# Altium schematic sheet digidisk.SchDoc
size A4; SheetNumber: 1; SheetTotal: 1
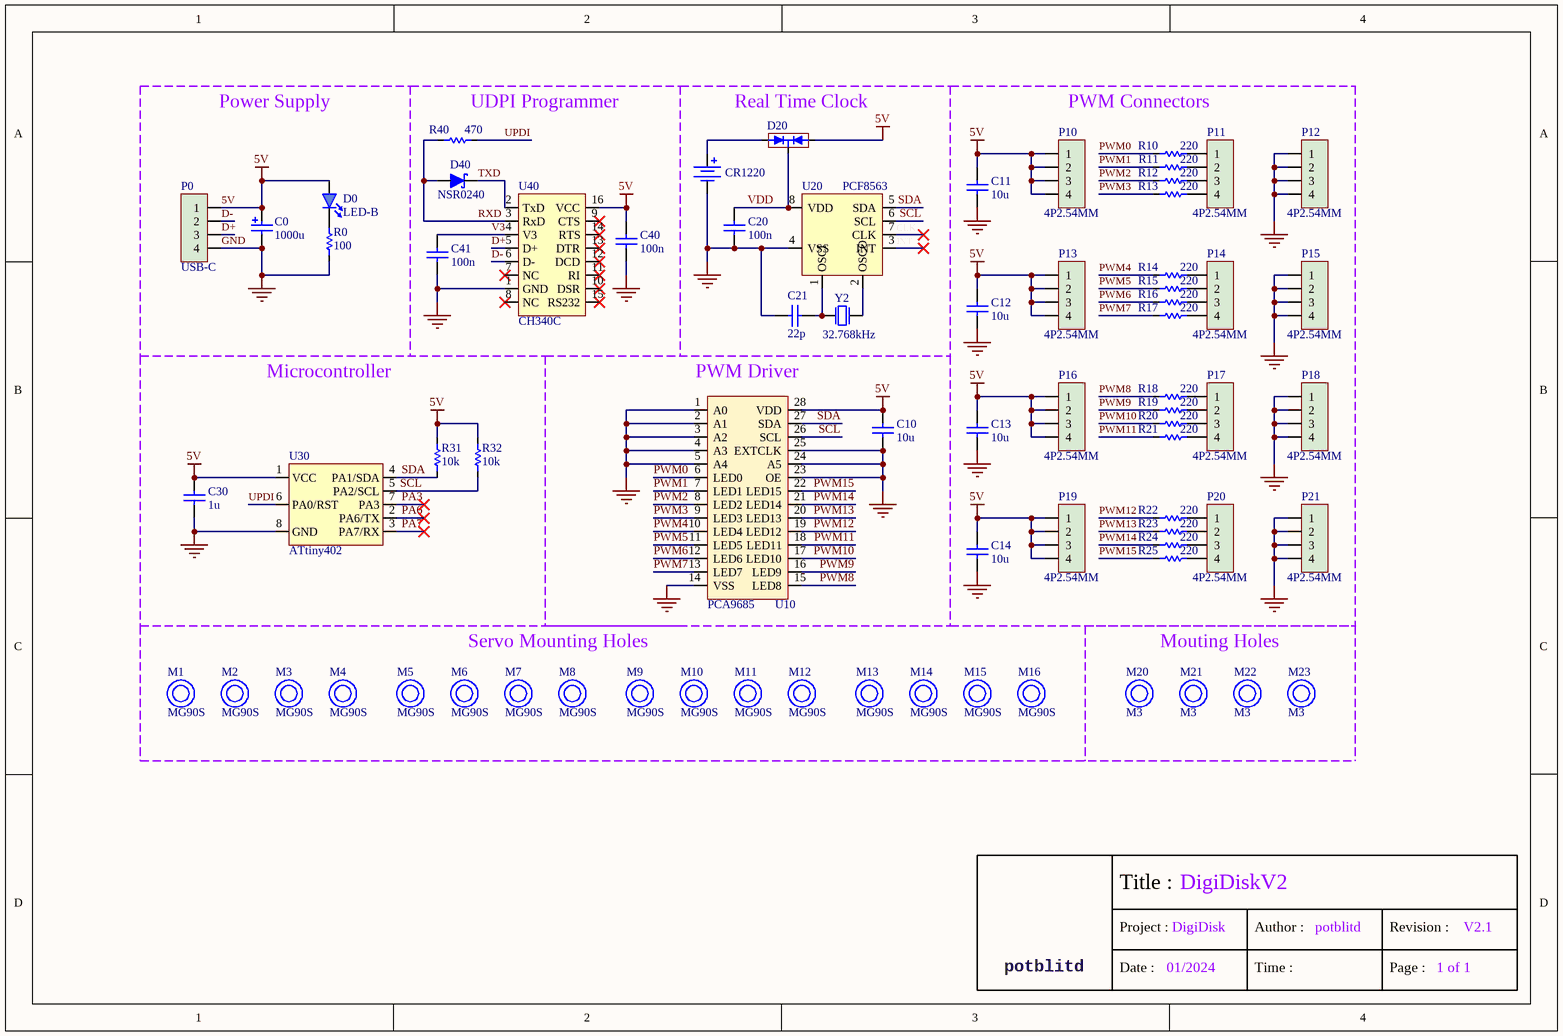
[diagram p0: digidisk.SchDoc]

## Parts
BT20  CR1220  [CR1220-H]
C0  1000u  [10X10.2]
C10  value 10u  [0603CM]  (hidden comment: Capacitor)
C11  value 10u  [0603CM]  (hidden comment: Capacitor)
C12  value 10u  [0603CM]  (hidden comment: Capacitor)
C13  value 10u  [0603CM]  (hidden comment: Capacitor)
C14  value 10u  [0603CM]  (hidden comment: Capacitor)
C20  value 100n  [0603CM]  (hidden comment: Capacitor)
C21  value 22p  [0603CM]  (hidden comment: Capacitor)
C30  value 1u  [0603CM]  (hidden comment: Capacitor)
C40  value 100n  [0603CM]  (hidden comment: Capacitor)
C41  value 100n  [0603CM]  (hidden comment: Capacitor)
D0  LED-B  [0603DM]
D20  BAS40-05  [SOT23-3 M]  (value not drawn)
D40  NSR0240  [SOD-323 M]
M1  MG90S  [HOLE-SG90-2]
M2  MG90S  [HOLE-SG90-2]
M3  MG90S  [HOLE-SG90-2]
M4  MG90S  [HOLE-SG90-2]
M5  MG90S  [HOLE-SG90-2]
M6  MG90S  [HOLE-SG90-2]
M7  MG90S  [HOLE-SG90-2]
M8  MG90S  [HOLE-SG90-2]
M9  MG90S  [HOLE-SG90-2]
M10  MG90S  [HOLE-SG90-2]
M11  MG90S  [HOLE-SG90-2]
M12  MG90S  [HOLE-SG90-2]
M13  MG90S  [HOLE-SG90-2]
M14  MG90S  [HOLE-SG90-2]
M15  MG90S  [HOLE-SG90-2]
M16  MG90S  [HOLE-SG90-2]
M20  M3  [HOLE-M3-simple]
M21  M3  [HOLE-M3-simple]
M22  M3  [HOLE-M3-simple]
M23  M3  [HOLE-M3-simple]
P0  USB-C  [USB-C module 2.8mm]
P10  4P2.54MM  [4P-2.54mm]
P11  4P2.54MM  [4P-2.54mm]
P12  4P2.54MM  [4P-2.54mm]
P13  4P2.54MM  [4P-2.54mm]
P14  4P2.54MM  [4P-2.54mm]
P15  4P2.54MM  [4P-2.54mm]
P16  4P2.54MM  [4P-2.54mm]
P17  4P2.54MM  [4P-2.54mm]
P18  4P2.54MM  [4P-2.54mm]
P19  4P2.54MM  [4P-2.54mm]
P20  4P2.54MM  [4P-2.54mm]
P21  4P2.54MM  [4P-2.54mm]
R0  value 100  [0603RM]  (hidden comment: Resistor)
R10  value 220  [0603RM]  (hidden comment: Resistor)
R11  value 220  [0603RM]  (hidden comment: Resistor)
R12  value 220  [0603RM]  (hidden comment: Resistor)
R13  value 220  [0603RM]  (hidden comment: Resistor)
R14  value 220  [0603RM]  (hidden comment: Resistor)
R15  value 220  [0603RM]  (hidden comment: Resistor)
R16  value 220  [0603RM]  (hidden comment: Resistor)
R17  value 220  [0603RM]  (hidden comment: Resistor)
R18  value 220  [0603RM]  (hidden comment: Resistor)
R19  value 220  [0603RM]  (hidden comment: Resistor)
R20  value 220  [0603RM]  (hidden comment: Resistor)
R21  value 220  [0603RM]  (hidden comment: Resistor)
R22  value 220  [0603RM]  (hidden comment: Resistor)
R23  value 220  [0603RM]  (hidden comment: Resistor)
R24  value 220  [0603RM]  (hidden comment: Resistor)
R25  value 220  [0603RM]  (hidden comment: Resistor)
R31  value 10k  [0603RM]  (hidden comment: Resistor)
R32  value 10k  [0603RM]  (hidden comment: Resistor)
R40  value 470  [0603RM]  (hidden comment: Resistor)
U10  PCA9685  [TSSOP-28 M]
U20  PCF8563  [SOP-8 M]
U30  ATtiny402  [SOP-8 M]
U40  CH340C  [SOP-16 M]
Y2  value 32.768kHz  [FC135 M]  (hidden comment: Oscillator)

## Nets
5V: C0.1(+) C10.1 C11.1 C12.1 C13.1 C14.1 C30.2 C40.1 D0.1 D20.1 P0.1 P10.1 P10.2 P10.3 P10.4 P13.1 P13.2 P13.3 P13.4 P16.1 P16.2 P16.3 P16.4 P19.1 P19.2 P19.3 P19.4 R31.2 R32.2 U10.28(VDD) U30.1(VCC) U40.16(VCC)
GND: BT20.2(-) C0.2(-) C10.2 C11.2 C12.2 C13.2 C14.2 C20.2 C21.2 C30.1 C40.2 C41.2 P0.4 P12.1 P12.2 P12.3 P12.4 P15.1 P15.2 P15.3 P15.4 P18.1 P18.2 P18.3 P18.4 P21.1 P21.2 P21.3 P21.4 R0.1 U10.1(A0) U10.2(A1) U10.3(A2) U10.4(A3) U10.5(A4) U10.14(VSS) U10.23(OE) U10.24(A5) U10.25(EXTCLK) U20.4(VSS) U30.8(GND) U40.1(GND)
CLK: U20.7(CLK)
D+: P0.3 U40.5(D+)
D-: P0.2 U40.6(D-)
INT: U20.3(INT)
PA3: U30.7(PA3)
PA6: U30.2(PA6/TX)
PA7: U30.3(PA7/RX)
PWM0: R10.2 U10.6(LED0)
PWM1: R11.2 U10.7(LED1)
PWM2: R12.2 U10.8(LED2)
PWM3: R13.2 U10.9(LED3)
PWM4: R14.2 U10.10(LED4)
PWM5: R15.2 U10.11(LED5)
PWM6: R16.2 U10.12(LED6)
PWM7: R17.2 U10.13(LED7)
PWM8: R18.2 U10.15(LED8)
PWM9: R19.2 U10.16(LED9)
PWM10: R20.2 U10.17(LED10)
PWM11: R21.2 U10.18(LED11)
PWM12: R22.2 U10.19(LED12)
PWM13: R23.2 U10.20(LED13)
PWM14: R24.2 U10.21(LED14)
PWM15: R25.2 U10.22(LED15)
RXD: D40.1(A) R40.2 U40.3(RxD)
SCL: R32.1 U10.26(SCL) U20.6(SCL) U30.5(PA2/SCL)
SDA: R31.1 U10.27(SDA) U20.5(SDA) U30.4(PA1/SDA)
TXD: D40.2(C) U40.2(TxD)
UPDI: R40.1 U30.6(PA0/RST)
V3: C41.1 U40.4(V3)
VDD: C20.1 D20.3 U20.8(VDD)
NetBT20_1: BT20.1(+) D20.2
NetC21_1: C21.1 U20.1(OSCI) Y2.2
NetD0_2: D0.2 R0.2
NetP11_1: P11.1 R10.1
NetP11_2: P11.2 R11.1
NetP11_3: P11.3 R12.1
NetP11_4: P11.4 R13.1
NetP14_1: P14.1 R14.1
NetP14_2: P14.2 R15.1
NetP14_3: P14.3 R16.1
NetP14_4: P14.4 R17.1
NetP17_1: P17.1 R18.1
NetP17_2: P17.2 R19.1
NetP17_3: P17.3 R20.1
NetP17_4: P17.4 R21.1
NetP20_1: P20.1 R22.1
NetP20_2: P20.2 R23.1
NetP20_3: P20.3 R24.1
NetP20_4: P20.4 R25.1
NetU20_2: U20.2(OSCO) Y2.1

Not connected (* = marked no-connect by the designer): U40 7(NC)* 8(NC)* 9(CTS)* 10(DSR)* 11(RI)* 12(DCD)* 13(DTR)* 14(RTS)* 15(RS232)*

## Notes on the sheet
- Power Supply
- (near R40) UDPI Programmer
- (near D20) Real Time Clock
- PWM Connectors
- Microcontroller
- (near U10) PWM Driver
- Servo Mounting Holes
- Mouting Holes
- Title :
- DigiDiskV2
- potblitd
- Project :
- Date :
- 01/2024
- DigiDisk
- Author :
- Time :
- Revision :
- Page :
- 1 of 1
- V2.1

## Library data of the parts
BT20 = Battery 3V: Coin cell battery 3V; Component: CR1220; Value: 3V
C0 = PCapacitor: Electrolytic Capacitor; Component: Cap10x10.2; Value: 1000u
C10-C14 = Capacitor: Capacitor 10u; Component: Cap0603
C20 C40 C41 = Capacitor: Capacitor 100nF ±10% 50V; Component: Cap0603
C21 = Capacitor: Capacitor 22pF ±5% 50V; Component: Cap0603
C30 = Capacitor: Capacitor 1uF; Component: Cap0603; Value: 1uF
D0 = LED-B: General LED symbol; Value: ~3V; Component: LED-B
D20 = Dual Diode 2: General symbol for a dual diode; Value: DD; Component: BAS40-05
D40 = Schottky Diode: Schottky Barrier Rectifiers; Value: SCH-D; Component: NSR0240
M1-M16 = Mounting Hole noGD: Genreal symbol for mechanical mounting hole; Component: MG90S
M20-M23 = Mounting Hole noGD: Genreal symbol for mechanical mounting hole; Value: 3.1mm; Component: M3
P0 = 4-pins Header: General 4-pin connection; Value: 4P; Component: 4P-2.54MM
P10-P21 = 4-pins Header: General 4-pin connection; Value: 4P; Component: 4P2.54MM
R0 R10-R25 R31 R32 R40 = RES: Component: Res0603
U10 = PCA9685: 16-channel, 12-bit PWM Fm+ I2C-bus LED controller; Value: TSSOP-28; Component: PCA9685
U20 = RTC-8563: IC real-time clock with alarm interrupt; Component: PCF8563T; Value: SOP-8
U30 = ATtiny202/402: tiny AVR 8-pin microcontroller; Value: SOP-8; Component: ATtiny402
U40 = CH340C-A: USB to serial; Value: USB-TTL; Component: CH340C
Y2 = XO-2: Crystal oscillator 32.768kHz 20ppm 12.5pF; Component: FC135